# EAGLE design NodeEssential.v2.cg2 (EAGLE 4.11)
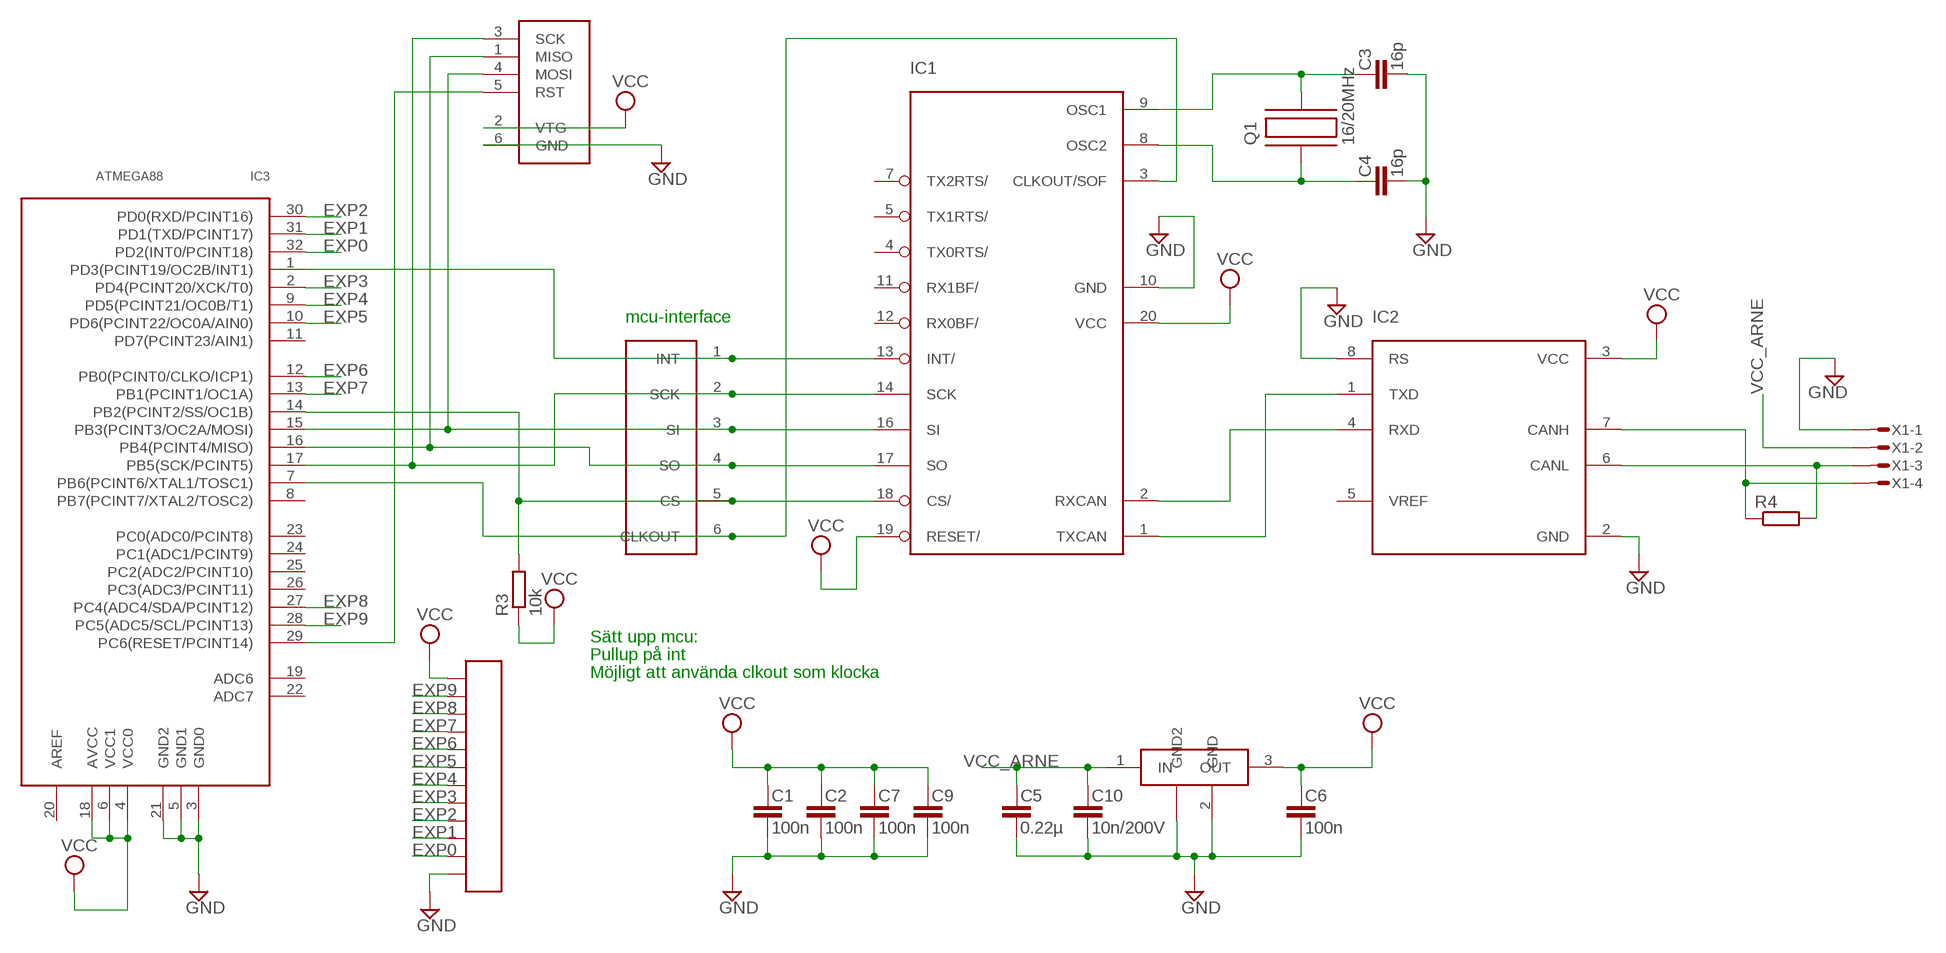
[diagram p0: schematic, sheet 1]

## Parts
C1  100n  C-EU  [C0603]
C2  100n  C-EU  [C0603]
C3  16p  C-EU  [C0603]
C4  16p  C-EU  [C0603]
C5  0.22µ  C-EU  [C0603]
C6  100n  C-EU  [C0603]
C7  100n  C-EU  [C0603]
C9  100n  C-EU  [C0603]
C10  10n/200V  C-EU  [C0603]
IC1  MCP2515  [TSSOP]
IC2  MCP2551  [TSSOP]
IC3  ATMEGA88  [TQFP32]
IC4  LM340MP-5.0  [SOT223]
Q1  16/20MHz  C-MAC-LFA147E  [SMD]
R3  10k  R-EUR0603  [R0603]
R4  R-EUR0603  [R0603]
U$1  CAN-INTERFACE  [VIA-LIST]
U$3  COLUMN  [COLUMN]
X1  MICROMATCH-4  [MICROMATCH-4-SMD]
X2  AVRISP6PIN  [6PIN]

## Nets
CANH: IC2.7(CANH) R4.1 X1.4
EXP0: IC3.32(PD2(INT0/PCINT18)) U$3.11
EXP1: IC3.31(PD1(TXD/PCINT17)) U$3.10
EXP2: IC3.30(PD0(RXD/PCINT16)) U$3.9
EXP3: IC3.2(PD4(PCINT20/XCK/T0)) U$3.8
EXP4: IC3.9(PD5(PCINT21/OC0B/T1)) U$3.7
EXP5: IC3.10(PD6(PCINT22/OC0A/AIN0)) U$3.6
EXP6: IC3.12(PB0(PCINT0/CLKO/ICP1)) U$3.5
EXP7: IC3.13(PB1(PCINT1/OC1A)) U$3.4
EXP8: IC3.27(PC4(ADC4/SDA/PCINT12)) U$3.3
EXP9: IC3.28(PC5(ADC5/SCL/PCINT13)) U$3.2
GND: C1.2 C2.2 C3.2 C4.2 C5.2 C6.2 C7.2 C9.2 C10.2 IC1.10(GND) IC2.2(GND) IC2.8(RS) IC3.3(GND0) IC3.5(GND1) IC3.21(GND2) IC4.2(GND) IC4.4(GND2) U$3.12 X1.1 X2.6(GND)
N$1: IC1.2(RXCAN) IC2.4(RXD)
N$2: IC1.1(TXCAN) IC2.1(TXD)
N$3: IC2.6(CANL) R4.2 X1.3
N$4: IC1.13(INT/) IC3.1(PD3(PCINT19/OC2B/INT1)) U$1.1(INT)
N$5: IC3.29(PC6(RESET/PCINT14)) X2.5(RST)
N$12: C3.1 IC1.9(OSC1) Q1.P$2
N$13: C4.1 IC1.8(OSC2) Q1.P$1
N$20: IC1.14(SCK) IC3.17(PB5(SCK/PCINT5)) U$1.2(SCK) X2.3(SCK)
N$21: IC1.16(SI) IC3.15(PB3(PCINT3/OC2A/MOSI)) U$1.3(SI) X2.4(MOSI)
N$22: IC1.17(SO) IC3.16(PB4(PCINT4/MISO)) U$1.4(SO) X2.1(MISO)
N$23: IC1.3(CLKOUT/SOF) IC3.7(PB6(PCINT6/XTAL1/TOSC1)) U$1.6(CLKOUT)
N$29: IC1.18(CS/) IC3.14(PB2(PCINT2/SS/OC1B)) R3.2 U$1.5(CS)
VCC: C1.1 C2.1 C6.1 C7.1 C9.1 IC1.19(RESET/) IC1.20(VCC) IC2.3(VCC) IC3.4(VCC0) IC3.6(VCC1) IC3.18(AVCC) IC4.3(OUT) R3.1 U$3.1 X2.2(VTG)
VCC_ARNE: C5.1 C10.1 IC4.1(IN) X1.2
Unconnected: IC1.4(TX0RTS/) IC1.5(TX1RTS/) IC1.7(TX2RTS/) IC1.11(RX1BF/) IC1.12(RX0BF/) IC2.5(VREF) IC3.8(PB7(PCINT7/XTAL2/TOSC2)) IC3.11(PD7(PCINT23/AIN1)) IC3.19(ADC6) IC3.20(AREF) IC3.22(ADC7) IC3.23(PC0(ADC0/PCINT8)) IC3.24(PC1(ADC1/PCINT9)) IC3.25(PC2(ADC2/PCINT10)) IC3.26(PC3(ADC3/PCINT11))

## Notes on the sheet
- mcu-interface
- Sätt upp mcu:
- Pullup på int
- Möjligt att använda clkout som klocka

## Library data of the parts
C1-C7 C9 C10 = rcl:C-EU
IC1 = mcp2515:MCP2515
IC2 = mcp2551:MCP2551
IC3 = atmega88:ATMEGA88
IC4 = lm340mp:LM340MP-5.0
Q1 = hc49-4h-smx:C-MAC-LFA147E
R3 R4 = rcl:R-EU
U$1 = can-interface:CAN-INTERFACE
U$3 = expboard:COLUMN
X1 = micromatch-smd:MICROMATCH-4: MicroMaTch 4 7-215464-4 / 0-215464-4 Drawing Number C-215464 DDEController.pdf
X2 = avrisp:AVRISP6PIN

## Board
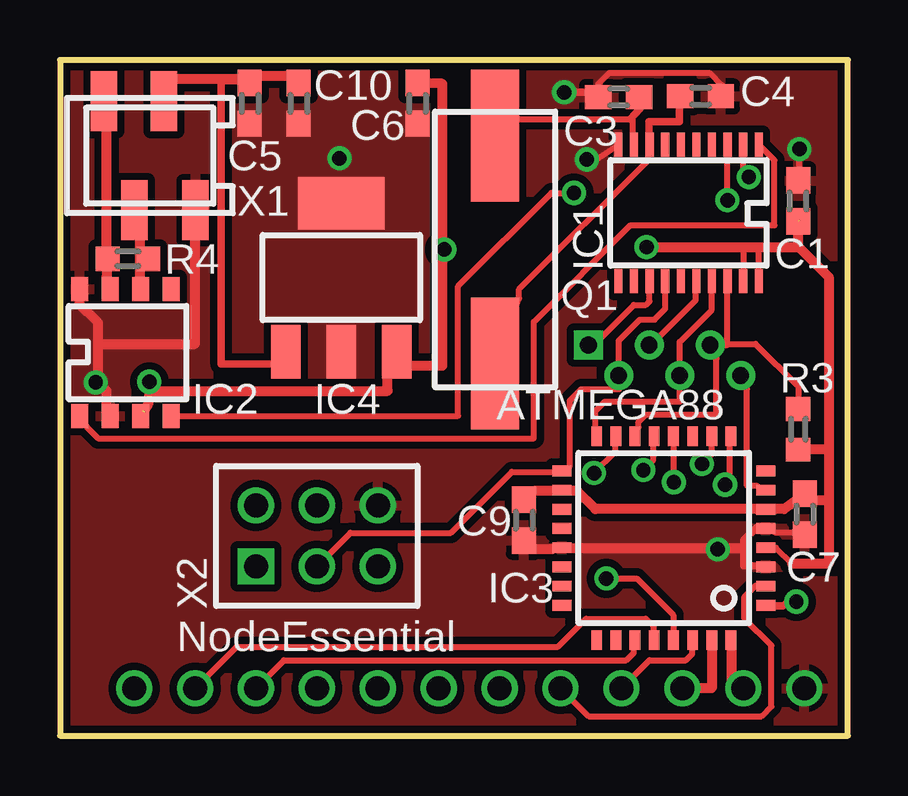
[diagram p1: board, top side]
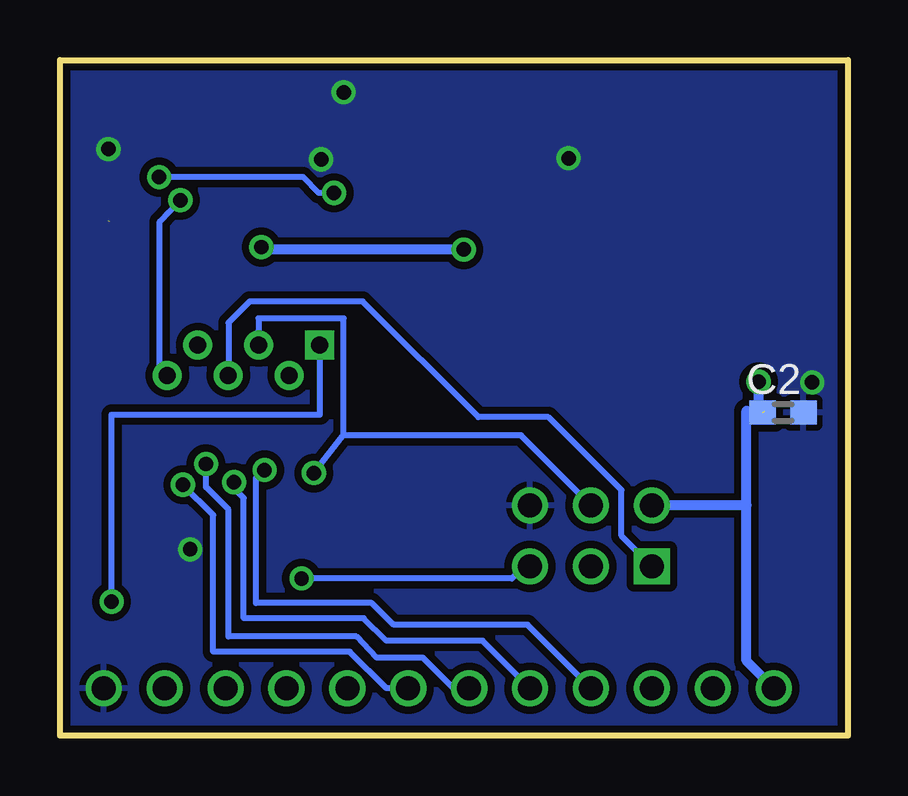
[diagram p2: board, bottom side, seen from below]

Size 32.85 x 28.17 mm. Coordinates in mm from the lower left corner, seen from the top.
Outline: 0,0 32.85,0 32.85,28.17 0,28.17 0,0
Copper layers (1*16): Top 0.035mm / dielectric 1.5mm / Bottom 0.035mm
Design rules "10mils, 0.6drill": minimum track width 10mil, minimum drill 0.6mm, track to track 10mil, track to pad 10mil, pad to pad 10mil, via to via 10mil, smd to smd 10mil, copper to edge 10mil, drill to drill 10mil, minimum pad ring 10mil, minimum via ring 8mil, stop-mask expansion 0mil, vias tented up to drill 0mil, thermal gap 10mil

### Footprints (pad centres in the part's own frame; a part is rotated, then mirrored left to right if it is on the bottom)
C0603 = smd 1.1 x 1: 1 -0.85,0; 2 0.85,0
TSSOP = smd 0.34 x 1: 1 -2.925,-2.85; 2 -2.275,-2.85; 3 -1.625,-2.85; 4 -0.975,-2.85; 5 -0.325,-2.85; 6 0.325,-2.85; 7 0.975,-2.85; 8 1.625,-2.85; 9 2.275,-2.85; 10 2.925,-2.85; 11 2.925,2.85; 12 2.275,2.85; 13 1.625,2.85; 14 0.975,2.85; 15 0.325,2.85; 16 -0.325,2.85; 17 -0.975,2.85; 18 -1.625,2.85; 19 -2.275,2.85; 20 -2.925,2.85
TSSOP' = smd 0.7 x 1: 1 -1.981,-2.645; 2 -0.711,-2.645; 3 0.559,-2.645; 4 1.829,-2.645; 5 1.829,2.645; 6 0.559,2.645; 7 -0.711,2.645; 8 -1.981,2.645
TQFP32 = smd 0.8 x 0.45: 1 -4.25,2.65; 2 -4.25,1.85; 3 -4.25,1.05; 4 -4.25,0.25; 5 -4.25,-0.55; 6 -4.25,-1.35; 7 -4.25,-2.15; 8 -4.25,-2.95; 17 4.25,-2.95; 18 4.25,-2.15; 19 4.25,-1.35; 20 4.25,-0.55; 21 4.25,0.25; 22 4.25,1.05; 23 4.25,1.85; 24 4.25,2.65 | smd 0.45 x 0.8: 9 -2.8,-4.4; 10 -2,-4.4; 11 -1.2,-4.4; 12 -0.4,-4.4; 13 0.4,-4.4; 14 1.2,-4.4; 15 2,-4.4; 16 2.8,-4.4; 25 2.8,4.1; 26 2,4.1; 27 1.2,4.1; 28 0.4,4.1; 29 -0.4,4.1; 30 -1.2,4.1; 31 -2,4.1; 32 -2.8,4.1
SOT223 = smd 1.219 x 2.235: 1 -2.311,-3.099; 2 0,-3.099; 3 2.311,-3.099 | smd 3.6 x 2.2: 4 0,3.099
SMD = smd 5.5 x 2: P$1 4.75,0; P$2 -4.75,0
R0603 = smd 0.991 x 1.016: 1 -0.85,0; 2 0.85,0
VIA-LIST = drill 0.7 square: 1 0,2.54 | drill 0.7 round: 2 -1.27,1.27; 3 0,0; 4 -1.27,-1.27; 5 0,-2.54; 6 -1.27,-3.81
COLUMN = drill 1 round: 1 0,15.24; 2 0,12.7; 3 0,10.16; 4 0,7.62; 5 0,5.08; 6 0,2.54; 7 0,0; 8 0,-2.54; 9 0,-5.08; 10 0,-7.62; 11 0,-10.16; 12 0,-12.7
MICROMATCH-4-SMD = smd 1.1 x 2.5: 1 1.905,-2.272; 2 0.585,2.272; 3 -0.635,-2.272; 4 -1.905,2.272
6PIN = drill 1 square: 1 -1.27,2.54 | drill 1 round: 2 1.27,2.54; 3 -1.27,0; 4 1.27,0; 5 -1.27,-2.54; 6 1.27,-2.54

### Placement (x,y rotation side)
C1  30.78,22.3 90 top
C2  2.7,13.47 0 bottom
C3  23.29,26.63 180 top
C4  26.7,26.66 0 top
C5  7.92,26.37 270 top
C6  14.9,26.37 270 top
C7  31.04,9.24 270 top
C9  19.34,8.98 270 top
C10  9.95,26.37 270 top
IC1  26.21,21.8 180 top
IC2  MCP2551  [TSSOP']  2.8,15.97 0 top
IC3  25.17,8.09 180 top
IC4  11.73,19.1 0 top
Q1  18.14,20.28 270 top
R3  30.78,12.78 90 top
R4  2.84,19.89 0 top
U$1  24.57,16.29 90 top
U$3  18.33,1.98 90 top
X1  3.75,24.18 0 top
X2  10.71,8.33 90 top

### Tracks (layer width: path | path; a pad name or v marks a point on that pad's centre or on a via)
CANH
  Top 0.254: R4.1 1.95,19.89 1.95,18.62 2.07,18.62
  Top 0.406: X1.4 1.95,25.92 1.95,19.89 1.95,19.13 2.07,18.87 2.07,18.62 IC2.7
EXP0
  Top 0.406: 27.98,3.99 27.98,4.01 | IC3.32 27.98,3.99 | U$3.11 27.98,1.98 27.98,3.99
EXP1
  Top 0.406: IC3.31 27.17,1.98 U$3.10
EXP2
  Top 0.254: U$3.9 24.58,3.15 26.1,3.15 26.36,3.4 26.36,3.97 IC3.30
EXP3
  Top 0.254: U$3.8 22.04,0.81 29.25,0.81 29.66,1.22 29.66,3.76 28.54,4.88 28.54,5.79 29,6.25 29.01,6.24 IC3.2
EXP4  (via drill 0.6)
  Top 0.254: v27.73,10.47 27.93,10.67 27.93,12.4 27.98,12.45 27.97,12.46 IC3.9
  Bottom 0.254: U$3.7 19.24,1.98 20.77,3.51 26.46,3.51 26.46,9.2 v27.73,10.47
EXP5  (via drill 0.6)
  Top 0.254: v26.76,11.33 27.17,11.74 27.17,12.45 IC3.10
  Bottom 0.254: U$3.6 16.45,1.98 17.72,3.25 19.65,3.25 20.49,4.14 25.82,4.14 25.82,9.42 26.76,10.36 v26.76,11.33
EXP6  (via drill 0.6)
  Top 0.254: IC3.12 25.59,12.47 v25.59,10.57
  Bottom 0.254: U$3.5 15.23,3.96 19.24,3.96 20.18,4.9 25.19,4.9 25.19,9.91 25.59,10.31 v25.59,10.57
EXP7  (via drill 0.6)
  Top 0.254: IC3.13 24.73,12.45 24.73,11.48 v24.32,11.08
  Bottom 0.254: U$3.4 13.35,4.62 18.94,4.62 19.85,5.54 24.68,5.54 24.68,10.75 24.2,11.02 v24.32,11.08
EXP8
  Top 0.254: U$3.3 9.34,3.15 23.61,3.15 23.92,3.46 23.92,3.91 23.97,3.97 IC3.27
EXP9
  Top 0.254: U$3.2 7.36,3.71 20.77,3.71 21.94,4.88 24.43,4.88 24.73,4.57 24.73,4.07 24.77,4.02 IC3.28
GND  (via drill 0.6)
  Top 0.254: v21.96,24.03 22.39,24.03 IC1.10 | v30.83,24.46 30.83,23.72 C1.2 | 1.59,14.73 v1.49,14.73 | 20.56,7.8 IC3.21 21.28,7.82 | C9.2 19.8,7.8 | 29.05,7.09 IC3.3 | 29.05,8.69 IC3.5 29.81,8.48 30.57,8.48 C7.2 | 27.27,7.82 v27.42,7.77 | C3.2 22.44,27.18 22.9,27.64 27.09,27.64 27.6,27.13 27.55,27.08 C4.2
  Top 0.305: IC2.2 1.95,13.77 | C3.2 22.15,26.82 v21.02,26.82 | 29.05,7.09 28.51,7.09 28.51,7.82 28.51,8.15 29.05,8.69
  Top 0.406: 1.95,13.77 1.95,14.38 1.59,14.73 1.59,16.33 | 1.59,16.33 1.59,17.22 0.83,17.98 IC2.8 | 19.8,7.8 20.56,7.8 | 21.28,7.82 27.27,7.82 28.51,7.82 | X1.1 5.63,20.66 5.63,16.33 1.59,16.33
  Bottom 0.305: v21.02,26.82 20.97,26.9
  other vias: 11.65,24.07
  pour Bottom (isolate 0.305): -0.01,28.19 32.83,28.19 32.83,-0.03 24.38,-0.03 -0.01,-0.03
  pour Top (isolate 0.305, no thermals): 6.7,27.58 15.89,27.58 15.89,14.52 6.7,14.52
  pour Top (isolate 0.305): -0.08,28.27 32.94,28.27 32.94,-0.05 -0.08,-0.05
N$1  (via drill 0.6)
  Top 0.254: v21.43,22.63 20.49,22.63 16.6,18.75 16.6,13.34 4.94,13.34 IC2.4 | v28.72,23.29 28.49,23.52 IC1.2
  Bottom 0.254: v21.43,22.63 22.06,22.63 22.72,23.29 v28.72,23.29
N$2
  Top 0.254: IC2.1 1.13,12.85 1.59,12.4 19.75,12.4 19.75,17.25 23.79,21.29 29.79,21.29 29.79,23.99 IC1.1
N$3
  Top 0.254: R4.2 3.34,19.89 3.34,19.76 3.34,18.62 IC2.6
  Top 0.406: IC2.6 3.34,18.64 3.34,19.76 3.34,20.79 X1.3
N$4  (via drill 0.6)
  Top 0.254: U$1.1 22.25,16.29 23.92,17.96 24.43,17.96 24.58,18.11 24.58,18.82 24.58,18.83 IC1.13 | 30.14,5.41 30.52,5.79 30.65,5.59 v30.7,5.59
  Top 0.305: IC3.1 29.63,5.44 29.63,5.41 30.14,5.41
  Bottom 0.254: v30.7,5.59 30.7,13.39 22.01,13.39 22.01,16.21 22.02,16.22 U$1.1
N$5  (via drill 0.6)
  Top 0.254: IC3.29 25.57,5.03 24.04,6.55 v22.77,6.55
  Bottom 0.254: v22.77,6.55 14.01,6.55 13.5,7.06 X2.5
N$12
  Top 0.254: IC1.9 23.87,25.12 23.87,25.71 23.79,25.71 19.14,25.71 Q1.P$2
  Top 0.305: C3.1 24.17,26.15 23.79,25.71
N$13
  Top 0.254: IC1.8 24.53,24.16 24.53,24 19.14,18.62 19.14,18.24 Q1.P$1
  Top 0.305: IC1.8 24.55,24.65 24.55,24.97 24.55,25.6 25.82,25.6 25.82,26.24 25.82,26.66 C4.1
N$20
  Top 0.254: IC1.14 25.23,18.92 25.19,18.87 25.24,18.82 25.24,17.81 24.78,17.35 24.17,17.35 23.29,16.47 U$1.2 23.29,14.95 23.31,14.45 21.73,14.45 21.25,13.97 21.25,11.23 IC3.17 20.88,11 18.84,11 16.3,8.46 12.11,8.46 X2.3
N$21  (via drill 0.6)
  Top 0.254: U$1.3 24.64,16.29 26.51,18.16 26.51,18.92 IC1.16 | v22.27,10.95 23.16,11.84 IC3.15
  Bottom 0.254: 21.04,12.56 v22.27,10.95 | 21.04,12.56 21.02,12.57 21.02,17.4 24.58,17.4 24.58,16.89 U$1.3 | 21.04,12.56 21,12.52 13.63,12.52 X2.4
N$22
  Top 0.254: IC1.17 27.18,18.89 27.17,18.87 27.17,17.76 25.84,16.42 U$1.4 25.84,14.95 25.82,13.92 22.7,13.92 22.29,13.51 22.29,12.8 IC3.16
  Bottom 0.254: X2.1 9.44,8.33 9.44,10.24 12.49,13.29 15.41,13.29 20.23,18.11 24.93,18.11 25.82,17.22 25.82,15.04 U$1.4
N$23  (via drill 0.6)
  Top 0.254: v27.83,22.33 27.83,24.16 IC1.3 | IC3.7 29.05,10.41 28.64,10.41 28.64,14.45 U$1.6
  Bottom 0.254: v27.83,22.33 28.69,21.44 28.69,15.34 U$1.6
N$29
  Top 0.254: IC1.18 27.83,16.33 | 27.83,16.33 27.83,16.29 U$1.5 27.37,15.72 27.37,13.39 24.43,13.39 24.12,13.08 24.12,12.85 IC3.14 | R3.2 30.78,14.55 29,16.33 27.83,16.33
VCC  (via drill 0.6)  (2 unrouted)
  Top 0.254: 3.73,14.3 3.78,14.38 | 29.81,9.45 IC3.6 29.05,9.45 | 21.28,10.21 IC3.18 | IC3.4 29.85,7.84 30.52,7.16 | IC1.20 29.12,20.37 29.68,20.37 | 28.49,18.87 28.48,18.88 IC1.19 28.49,18.87 | 28.49,20.37 28.49,18.87
  Top 0.305: 13.66,15.14 IC4.3
  Top 0.406: C6.1 15.95,27.18 15.95,20.27 | 15.95,20.27 15.95,15.43 14.08,15.43 14.08,16.25 IC4.3 | 3.78,14.38 13.66,14.38 13.66,15.14 | IC2.3 3.67,13.82 3.73,14.3 v3.73,14.76 | 15.95,20.27 v16.02,20.27 | v24.45,20.37 28.49,20.37 29.68,20.37 | 29.68,20.37 | IC3.18 20.56,10.21 19.8,10.21 C9.1 | 30.52,7.16 32.05,7.16 32.05,9.8 | 32.05,9.8 31.41,9.8 C7.1 30.19,9.45 29.81,9.45 | 21.28,10.21 21.56,10.21 22.32,9.45 29.05,9.45 | 32.05,11.89 32.05,9.8 | 30.78,21.54 30.84,21.48 | 29.68,20.37 30.78,20.37 30.78,20.4 | 30.78,20.4 C1.1 | R3.1 32.05,11.93 32.05,11.89 | 32.05,11.89 32.05,19.13 30.78,20.4
  Bottom 0.254: C2.1 3.73,13.97
  Bottom 0.406: 3.73,13.97 v3.73,14.76 | v24.45,20.37 24.4,20.37 24.3,20.27 v16.02,20.27 | U$3.1 4.23,3.12 4.23,9.6 | 4.23,9.6 4.23,13.54 3.47,13.54 | 4.23,9.6 X2.2
VCC_ARNE
  Top 0.305: 6.72,27.31 7.84,27.31 C5.1 | 6.72,27.31 7.48,27.38 | 6.72,27.31 6.72,15.5 9.31,15.5 9.31,16 IC4.1
  Top 0.406: C10.1 9.95,27.51 7.92,27.51 C5.1 | 7.54,27.38 7.48,27.38 4.5,27.38 X1.2

### Text on the board
tNames: NodeEssential
tDocu: VCC | GND | 9 | 8 | 7 | 6 | 5 | 4 | 3 | 0 | 1 | 2